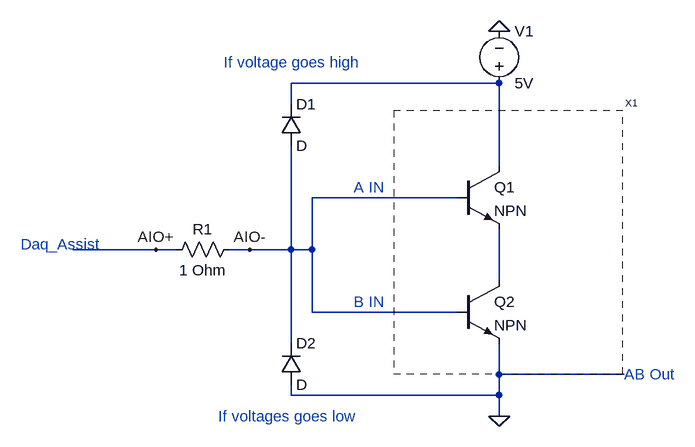
[diagram p0: schematic InClass Circuit.asc]
InClass Circuit.asc, the LTspice schematic file:
Version 4
SHEET 1 880 680
WIRE 240 128 -80 128
WIRE -80 160 -80 128
WIRE 240 256 240 128
WIRE 176 304 -48 304
WIRE -288 384 -416 384
WIRE -256 384 -288 384
WIRE -144 384 -176 384
WIRE -80 384 -80 224
WIRE -80 384 -144 384
WIRE -48 384 -48 304
WIRE -48 384 -80 384
WIRE 240 432 240 352
WIRE -48 480 -48 384
WIRE 176 480 -48 480
WIRE -80 528 -80 384
WIRE 240 576 240 528
WIRE 432 576 240 576
WIRE -80 608 -80 592
WIRE 240 608 240 576
WIRE 240 608 -80 608
WIRE 240 640 240 608
FLAG 240 640 0
FLAG 240 48 0
FLAG -144 384 AIO-
FLAG -288 384 AIO+
SYMBOL voltage 240 144 M180
WINDOW 0 24 96 Left 2
WINDOW 3 24 16 Left 2
SYMATTR InstName V1
SYMATTR Value 5V
SYMBOL npn 176 256 R0
SYMATTR InstName Q1
SYMBOL npn 176 432 R0
SYMATTR InstName Q2
SYMBOL diode -96 224 M180
WINDOW 0 24 64 Left 2
WINDOW 3 24 0 Left 2
SYMATTR InstName D1
SYMBOL diode -96 592 M180
WINDOW 0 24 64 Left 2
WINDOW 3 24 0 Left 2
SYMATTR InstName D2
SYMBOL res -160 368 R90
WINDOW 0 0 56 VBottom 2
WINDOW 3 32 56 VTop 2
SYMATTR InstName R1
SYMATTR Value 1 Ohm
SYMBOL blackbox2 80 576 R0
SYMATTR InstName X1
TEXT 432 576 Left 2 ;AB Out
TEXT 16 288 Left 2 ;A IN
TEXT 16 464 Left 2 ;B IN
TEXT -496 376 Left 2 ;Daq_Assist
TEXT -192 640 Left 2 ;If voltages goes low
TEXT -184 96 Left 2 ;If voltage goes high

The netlist it stands for:
* InClass Circuit.asc
V1 N001 0 5V
Q1 N001 AIO- N002 0 NPN
Q2 N002 AIO- 0 0 NPN
D1 AIO- N001 D
D2 0 AIO- D
R1 AIO- AIO+ 1 Ohm
XX1 blackbox2
.model D D
.lib standard.dio
.model NPN NPN
.model PNP PNP
.lib standard.bjt
* AB Out
* A IN
* B IN
* Daq_Assist
* If voltages goes low
* If voltage goes high
.backanno
.end